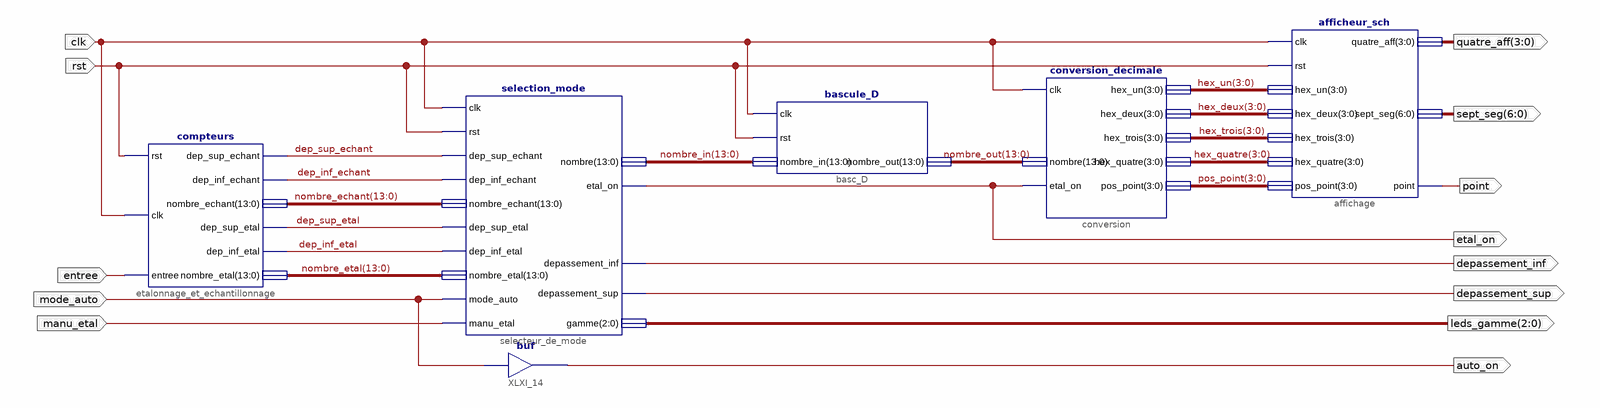
[diagram p0: schematic sheet 1]
// Xilinx ISE schematic main_sch.sch (spartan3e) as structural Verilog: 6 symbols, 13 ports
module main_sch (
  input  clk,
  input  rst,
  input  mode_auto,
  input  manu_etal,
  input  entree,
  output auto_on,
  output etal_on,
  output depassement_sup,
  output depassement_inf,
  output [2:0] leds_gamme,
  output point,
  output [6:0] sept_seg,
  output [3:0] quatre_aff
);

  wire dep_inf_echant, dep_inf_etal, dep_sup_echant, dep_sup_etal;
  wire [3:0] hex_deux, hex_quatre, hex_trois, hex_un, pos_point;
  wire [13:0] nombre_echant, nombre_etal, nombre_in, nombre_out;

  bascule_D basc_D (.clk(clk), .rst(rst), .nombre_in(nombre_in), .nombre_out(nombre_out));
  conversion_decimale conversion (
    .etal_on(etal_on), .clk(clk), .nombre(nombre_out), .hex_un(hex_un), .hex_deux(hex_deux),
    .hex_trois(hex_trois), .hex_quatre(hex_quatre), .pos_point(pos_point));
  buf XLXI_14 (auto_on, mode_auto);
  afficheur_sch affichage (
    .clk(clk), .rst(rst), .hex_un(hex_un), .hex_deux(hex_deux), .hex_trois(hex_trois),
    .hex_quatre(hex_quatre), .pos_point(pos_point), .quatre_aff(quatre_aff), .sept_seg(sept_seg),
    .point(point));
  compteurs etalonnage_et_echantillonnage (
    .rst(rst), .clk(clk), .entree(entree), .dep_sup_echant(dep_sup_echant), .dep_inf_echant(dep_inf_echant),
    .nombre_echant(nombre_echant), .dep_sup_etal(dep_sup_etal), .dep_inf_etal(dep_inf_etal),
    .nombre_etal(nombre_etal));
  selection_mode selecteur_de_mode (
    .clk(clk), .rst(rst), .dep_sup_echant(dep_sup_echant), .dep_inf_echant(dep_inf_echant),
    .nombre_echant(nombre_echant), .dep_sup_etal(dep_sup_etal), .dep_inf_etal(dep_inf_etal),
    .nombre_etal(nombre_etal), .mode_auto(mode_auto), .manu_etal(manu_etal), .gamme(leds_gamme),
    .depassement_sup(depassement_sup), .nombre(nombre_in), .depassement_inf(depassement_inf),
    .etal_on(etal_on));
endmodule
